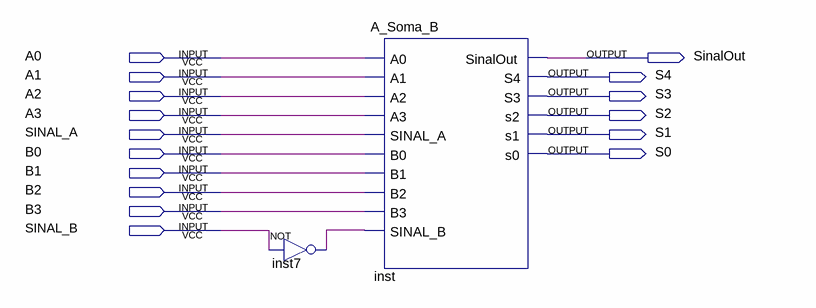
[diagram p0: schematic sheet]
// Quartus schematic A_Subtracao_B.bdf as structural Verilog: 2 symbols, 16 pins
module A_Subtracao_B (
  input  A0,
  input  A1,
  input  A2,
  input  A3,
  input  SINAL_A,
  input  B0,
  input  B1,
  input  B2,
  input  B3,
  input  SINAL_B,
  output SinalOut,
  output S4,
  output S3,
  output S2,
  output S1,
  output S0
);

  wire inst7_out;

  not inst7 (inst7_out, SINAL_B);
  A_Soma_B inst (
    .A0(A0), .A1(A1), .A2(A2), .A3(A3), .SINAL_A(SINAL_A), .B0(B0), .B1(B1), .B2(B2), .B3(B3),
    .SINAL_B(inst7_out), .SinalOut(SinalOut), .S4(S4), .S3(S3), .s2(S2), .s1(S1), .s0(S0));
endmodule
